# EAGLE design fullcircuit4layer1.1b (EAGLE 7.7.0)
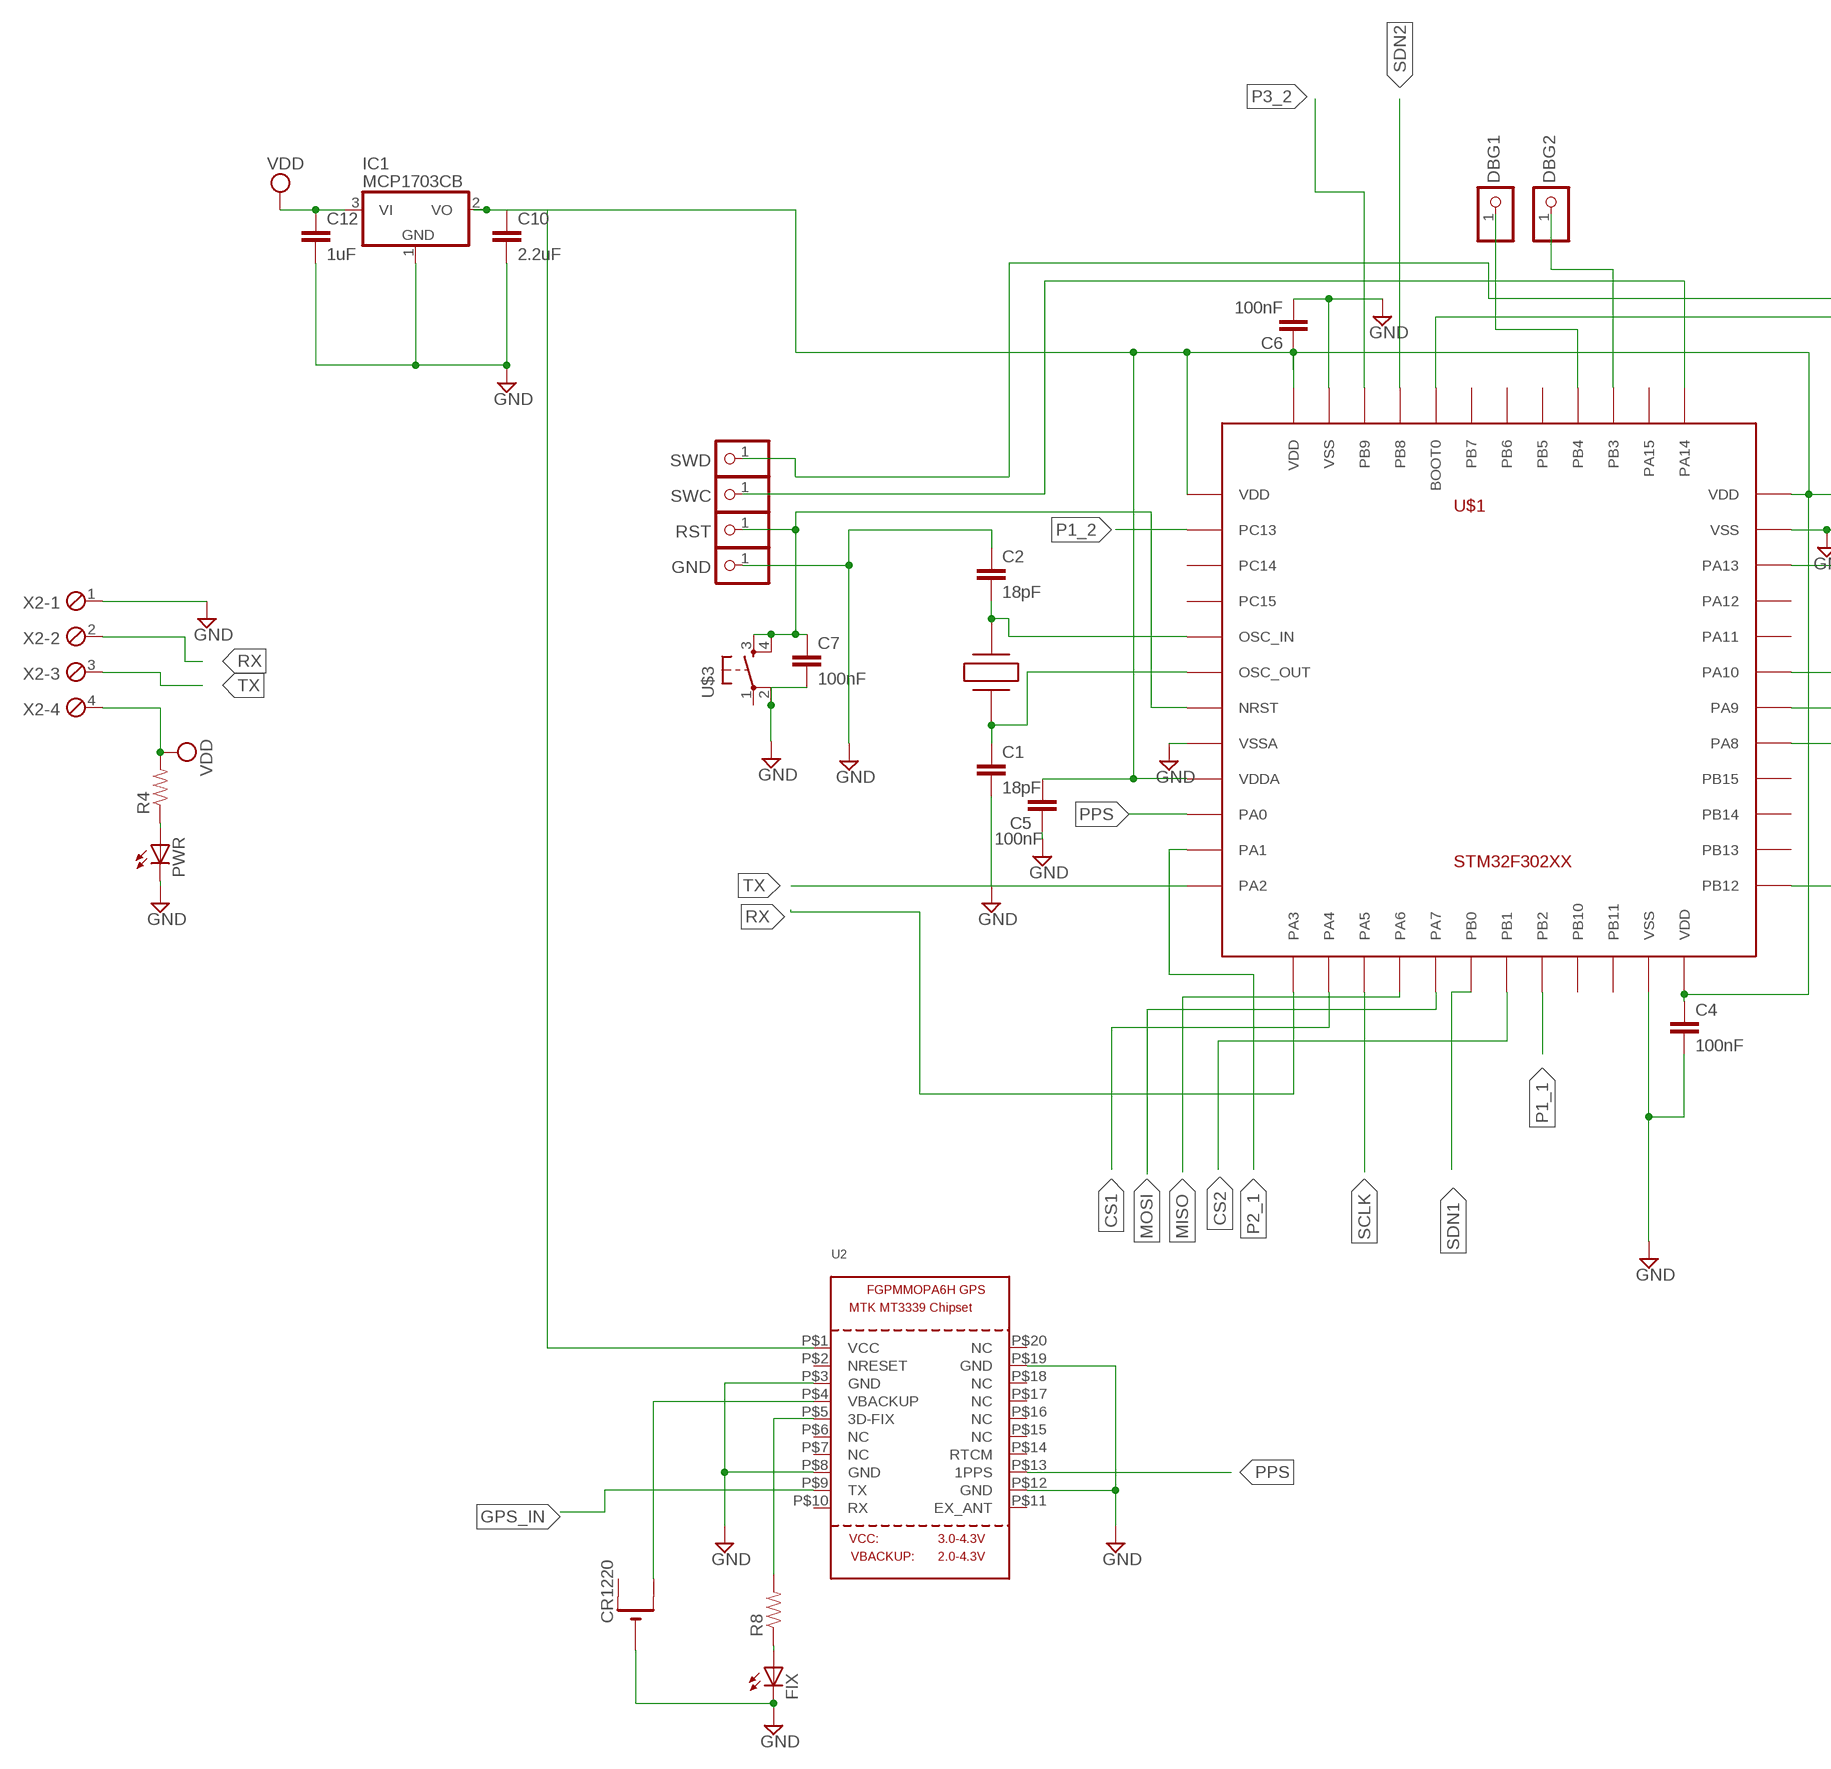
[diagram p0: schematic, sheet 1, part 1 of 2]
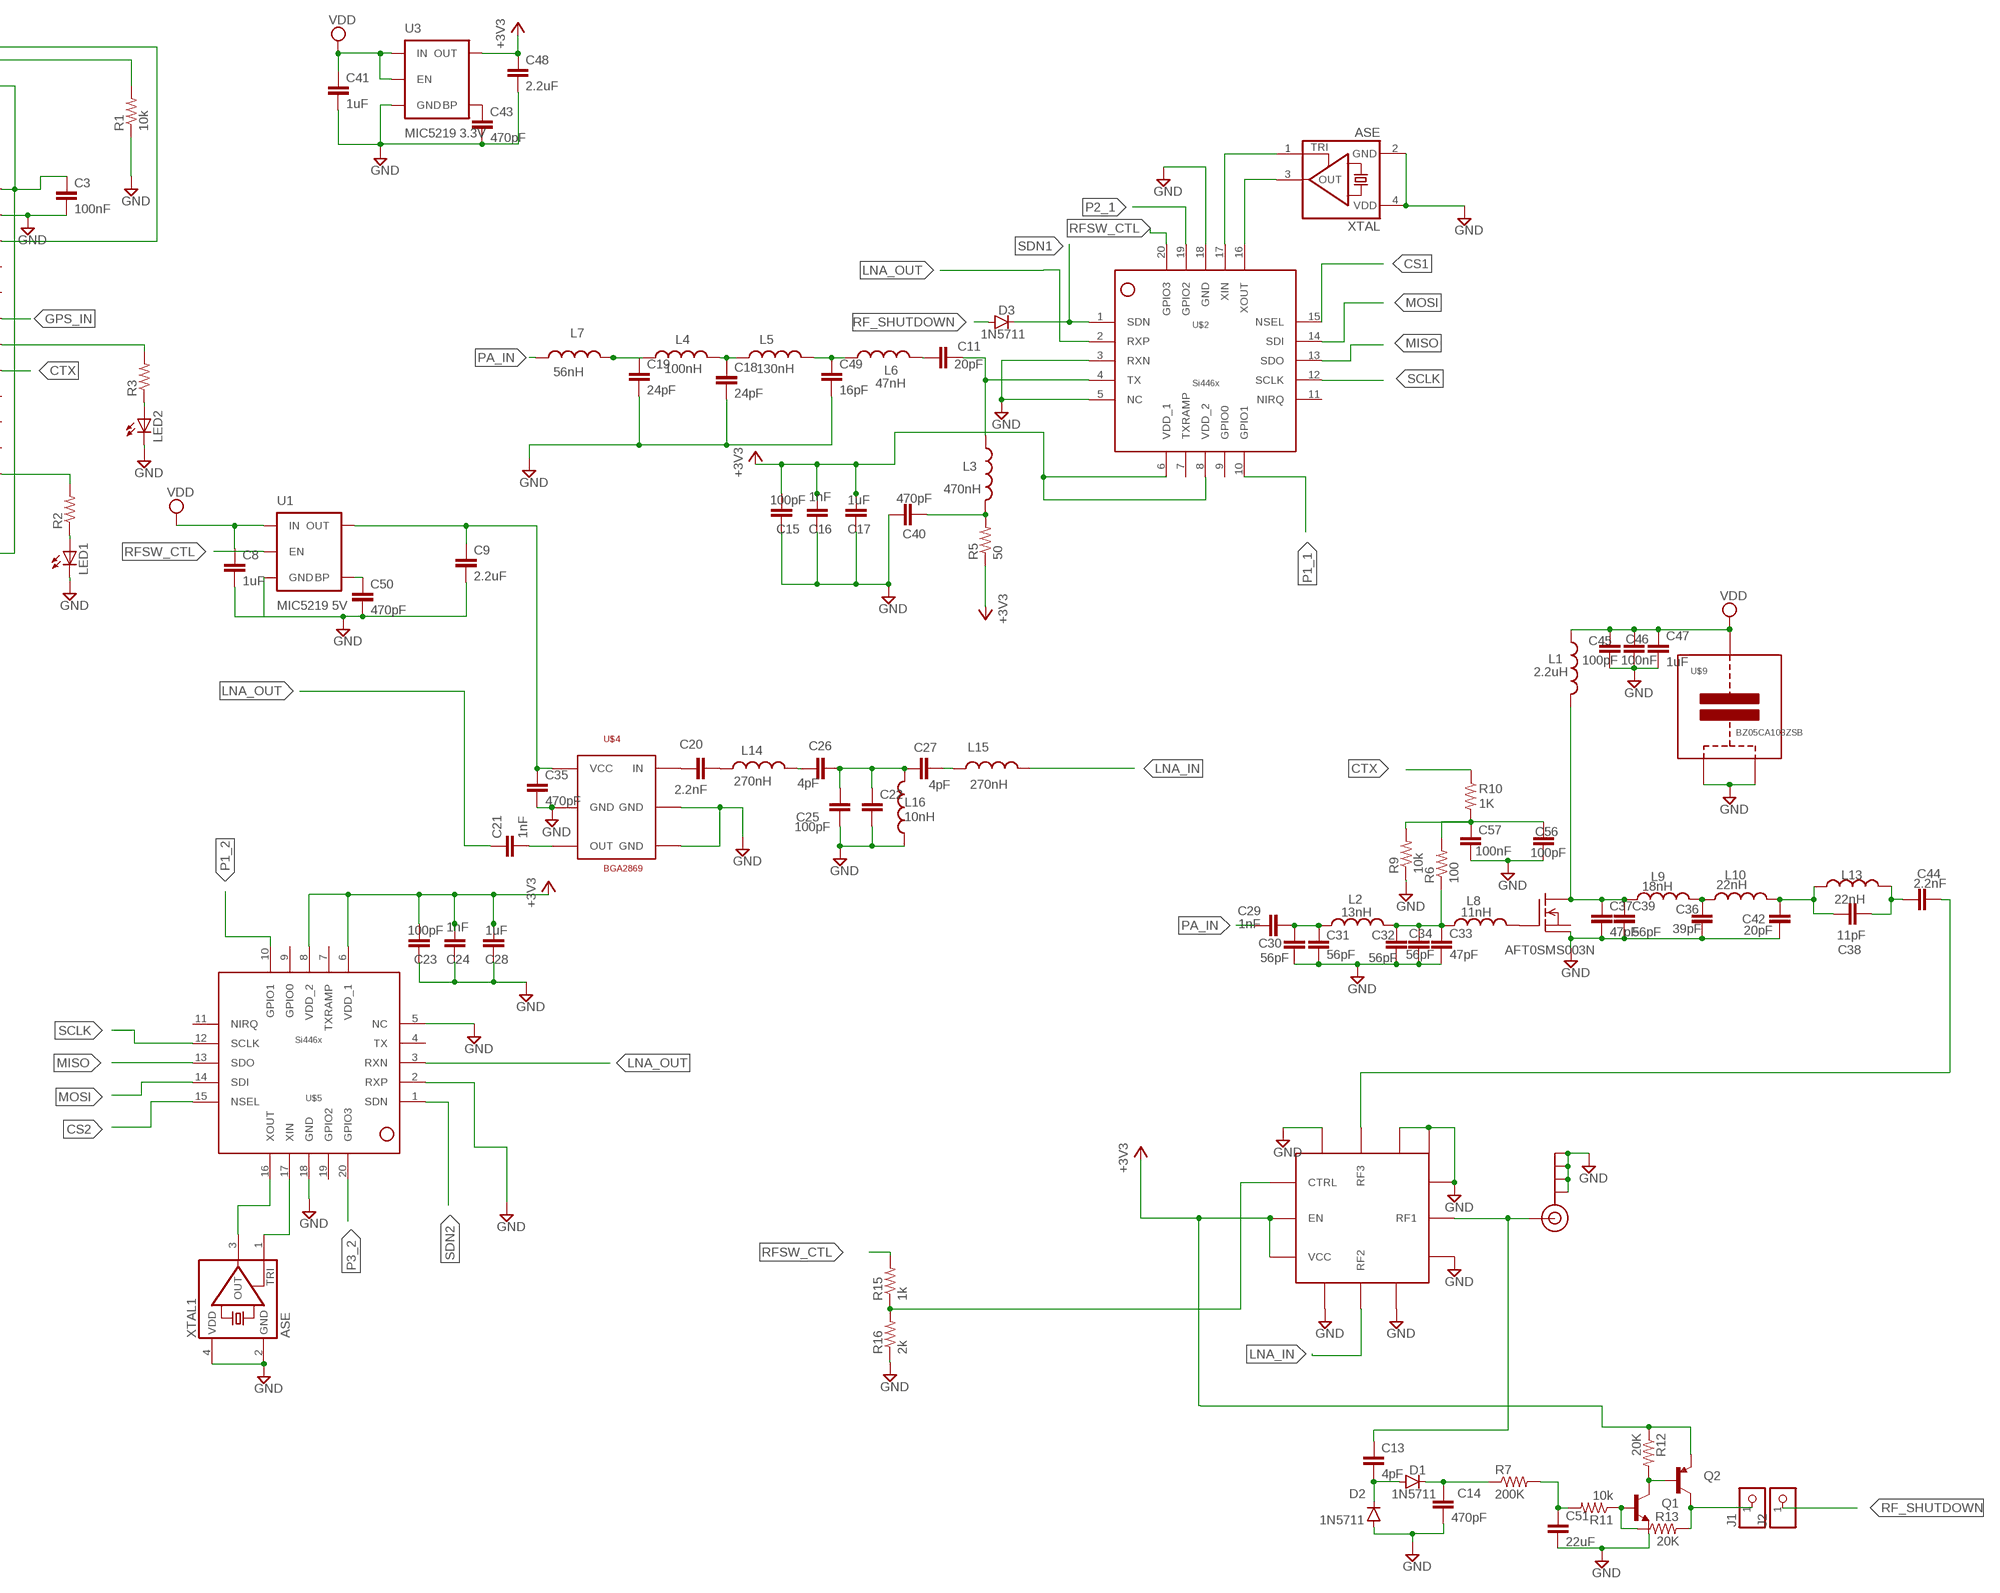
[diagram p1: schematic, sheet 1, part 2 of 2]

## Parts
C1  18pF  CAP0603-CAP  [0603-CAP]
C2  18pF  CAP0603-CAP  [0603-CAP]
C3  100nF  CAP0603-CAP  [0603-CAP]
C4  100nF  CAP0603-CAP  [0603-CAP]
C5  100nF  CAP0603-CAP  [0603-CAP]
C6  100nF  CAP0603-CAP  [0603-CAP]
C7  100nF  CAP0603-CAP  [0603-CAP]
C8  1uF  CAP0603-CAP  [0603-CAP]
C9  2.2uF  CAP0603-CAP  [0603-CAP]
C10  2.2uF  CAP0805  [0805]
C11  20pF  CAP0603-CAP  [0603-CAP]
C12  1uF  CAP0603-CAP  [0603-CAP]
C13  4pF  CAP0603-CAP  [0603-CAP]
C14  470pF  CAP0603-CAP  [0603-CAP]
C15  100pF  CAP0603-CAP  [0603-CAP]
C16  1nF  CAP0603-CAP  [0603-CAP]
C17  1uF  CAP0603-CAP  [0603-CAP]
C18  24pF  CAP0603-CAP  [0603-CAP]
C19  24pF  CAP0603-CAP  [0603-CAP]
C20  2.2nF  CAP0805  [0805]
C21  1nF  CAP0805  [0805]
C22  CAP0603-CAP  [0603-CAP]
C23  100pF  CAP0603-CAP  [0603-CAP]
C24  1nF  CAP0603-CAP  [0603-CAP]
C25  100pF  CAP0603-CAP  [0603-CAP]
C26  4pF  CAP0603-CAP  [0603-CAP]
C27  4pF  CAP0603-CAP  [0603-CAP]
C28  1uF  CAP0603-CAP  [0603-CAP]
C29  1nF  CAP0805  [0805]
C30  56pF  CAP0603-CAP  [0603-CAP]
C31  56pF  CAP0603-CAP  [0603-CAP]
C32  56pF  CAP0603-CAP  [0603-CAP]
C33  47pF  CAP0603-CAP  [0603-CAP]
C34  56pF  CAP0603-CAP  [0603-CAP]
C35  470pF  CAP0603-CAP  [0603-CAP]
C36  39pF  CAP0805  [0805]
C37  47pF  CAP0805  [0805]
C38  11pF  CAP0805  [0805]
C39  56pF  CAP0805  [0805]
C40  470pF  CAP0603-CAP  [0603-CAP]
C41  1uF  CAP0603-CAP  [0603-CAP]
C42  20pF  CAP0805  [0805]
C43  470pF  CAP0603-CAP  [0603-CAP]
C44  2.2nF  CAP0805  [0805]
C45  100pF  CAP0805  [0805]
C46  100nF  CAP0805  [0805]
C47  1uF  CAP0805  [0805]
C48  2.2uF  CAP0603-CAP  [0603-CAP]
C49  16pF  CAP0603-CAP  [0603-CAP]
C50  470pF  CAP0603-CAP  [0603-CAP]
C51  22uF  CAP0805  [0805]
C56  100pF  CAP0603-CAP  [0603-CAP]
C57  100nF  CAP0603-CAP  [0603-CAP]
CR1220  CR1220SMT  [CR1220-SMD]
D1  1N5711  DIODESOD123  [SOD-123]
D2  1N5711  DIODESOD123  [SOD-123]
D3  1N5711  DIODESOD123  [SOD-123]
DBG1  PINHD-1X1  [1X01]
DBG2  PINHD-1X1  [1X01]
FIX  LEDCHIP-LED0603  [CHIP-LED0603]
GND  PINHD-1X1  [1X01]
IC1  MCP1703CB  [SOT23]
J1  PINHD-1X1  [1X01]
J2  PINHD-1X1  [1X01]
J$1  SMA_EDGE  [SMA-EDGE]
L1  2.2uH  INDUCTOR0805  [0805]
L2  13nH  INDUCTOR0603  [0603]
L3  470nH  INDUCTOR0805  [0805]
L4  100nH  INDUCTOR30OHM,1.8A  [0603]
L5  130nH  INDUCTOR30OHM,1.8A  [0603]
L6  47nH  INDUCTOR30OHM,1.8A  [0603]
L7  56nH  INDUCTOR30OHM,1.8A  [0603]
L8  11nH  INDUCTOR0603  [0603]
L9  18nH  INDUCTOR0805  [0805]
L10  22nH  INDUCTOR0805  [0805]
L13  22nH  INDUCTOR0805  [0805]
L14  270nH  INDUCTOR30OHM,1.8A  [0603]
L15  270nH  INDUCTOR30OHM,1.8A  [0603]
L16  10nH  INDUCTOR30OHM,1.8A  [0603]
LED1  LEDCHIP-LED0603  [CHIP-LED0603]
LED2  LEDCHIP-LED0603  [CHIP-LED0603]
PWR  LEDCHIP-LED0603  [CHIP-LED0603]
Q1  TRANSISTOR_NPNSOT23-3  [SOT23-3]
Q2  TRANSISTOR_PNPSMD  [SOT23-3]
R1  10k  RESISTOR0603-RES  [0603-RES]
R2  RESISTOR0603-RES  [0603-RES]
R3  RESISTOR0603-RES  [0603-RES]
R4  RESISTOR0603-RES  [0603-RES]
R5  50  RESISTOR0603-RES  [0603-RES]
R6  100  RESISTOR0603-RES  [0603-RES]
R7  200K  RESISTOR0603-RES  [0603-RES]
R8  RESISTOR0603-RES  [0603-RES]
R9  10k  RESISTOR0603-RES  [0603-RES]
R10  1K  RESISTOR0603-RES  [0603-RES]
R11  10k  RESISTOR0603-RES  [0603-RES]
R12  20K  RESISTOR0603-RES  [0603-RES]
R13  20K  RESISTOR0603-RES  [0603-RES]
R15  1k  RESISTOR0603-RES  [0603-RES]
R16  2k  RESISTOR0603-RES  [0603-RES]
RST  PINHD-1X1  [1X01]
SWC  PINHD-1X1  [1X01]
SWD  PINHD-1X1  [1X01]
U1  MIC5219 5V  V_REG_MIC52195V  [SOT23-5]
U2  GPS_FGPMMOPA6H  [FGPMMOPA6H]
U3  MIC5219 3.3V  V_REG_MIC52193.3V  [SOT23-5]
U$1  STM32F302XX  [LQFP48]
U$2  SI4463  [SI4463]
U$3  TACTILE-SWITCH-7914G  [7914G]
U$4  BGA2869  [SOT363]
U$5  SI4463  [SI4463]
U$6  SKYWORKS-13330397LF  [QFN12]
U$7  AFT0SMS003N  [SOT-89]
U$9  BZ05CA103ZSB  [BZ05]
X1  TXC_7A  [TXC_7A]
X2  MPT4  [4POL254]
XTAL  ASE  [ASE]
XTAL1  ASE  [ASE]

## Nets
+3V3: C15.1 C16.1 C17.1 C23.1 C24.1 C28.1 C48.1 Q2.2(E) R5.1 R12.1 U3.5(OUT) U$2.6(VDD_1) U$2.8(VDD_2) U$5.6(VDD_1) U$5.8(VDD_2) U$6.P$8(EN) U$6.P$9(VCC)
ANT: C13.1 J$1.SIG(SIGNAL) U$6.P$2(RF1)
CS1: U$1.P$14(PA4) U$2.15(NSEL)
CS2: U$1.P$19(PB1) U$5.15(NSEL)
CTX: R10.1 U$1.P$29(PA8)
GND: C1.2 C2.1 C3.2 C4.2 C5.1 C6.2 C7.2 C8.2 C9.2 C10.2 C12.2 C14.2 C15.2 C16.2 C17.2 C18.2 C19.2 C22.2 C23.2 C24.2 C25.1 C28.2 C30.2 C31.2 C32.2 C33.2 C34.2 C35.2 C36.2 C37.2 C39.2 C40.2 C41.2 C42.2 C43.2 C45.2 C46.2 C47.2 C48.2 C49.2 C50.2 C51.2 C56.2 C57.2 CR1220.- D2.A FIX.C GND.1 IC1.1(GND) J$1.GND@0(GND) J$1.GND@1(GND) J$1.GND@2(GND) J$1.GND@3(GND) L16.1 LED1.C LED2.C PWR.C Q1.2(E) R1.1 R9.1 R16.1 U1.2(GND) U2.P$3(GND) U2.P$8(GND) U2.P$12(GND) U2.P$19(GND) U3.2(GND) U$1.P$8(VSSA) U$1.P$23(VSS) U$1.P$35(VSS) U$1.P$47(VSS) U$2.3(RXN) U$2.5(NC) U$2.18(GND) U$3.2 U$4.2(GND) U$4.4(GND) U$4.5(GND) U$5.2(RXP) U$5.5(NC) U$5.18(GND) U$6.P$1(GND) U$6.P$3(GND) U$6.P$4(GND) U$6.P$6(GND) U$6.P$10(GND) U$6.P$12(GND) U$7.2@1(PAD) U$9.P$1 U$9.P$2 X2.1 XTAL1.2(GND) XTAL1.4(VDD) XTAL.2(GND) XTAL.4(VDD)
GPS_IN: U2.P$9(TX) U$1.P$31(PA10)
LNA_IN: L15.2 U$6.P$11(RF2)
LNA_OUT: C21.1 U$2.2(RXP) U$5.3(RXN)
LNAPWR: C9.1 C35.1 U1.5(OUT) U$4.1(VCC)
MISO: U$1.P$16(PA6) U$2.13(SDO) U$5.13(SDO)
MOSI: U$1.P$17(PA7) U$2.14(SDI) U$5.14(SDI)
N$1: U$2.17(XIN) XTAL.1(TRI)
N$2: C19.1 L4.1 L7.2
N$3: C18.1 L4.2 L5.1
N$4: R1.2 U$1.P$44(BOOT0)
N$5: SWC.1 U$1.P$37(PA14)
N$6: R2.2 U$1.P$25(PB12)
N$7: SWD.1 U$1.P$34(PA13)
N$8: C11.1 L3.1 U$2.4(TX)
N$9: C2.2 U$1.P$5(OSC_IN) X1.P$2
N$10: C20.1 U$4.6(IN)
N$11: C21.2 U$4.3(OUT)
N$12: FIX.A R8.1
N$13: U$2.16(XOUT) XTAL.3(OUT)
N$14: LED1.A R2.1
N$15: C20.2 L14.1
N$16: LED2.A R3.1
N$17: R3.2 U$1.P$30(PA9)
N$18: C1.1 U$1.P$6(OSC_OUT) X1.P$1
N$19: PWR.A R4.1
N$20: C49.1 L5.2 L6.1
N$21: DBG2.1 U$1.P$39(PB3)
N$22: C3.1 C4.1 C5.2 C6.1 C10.1 IC1.2(VO) U2.P$1(VCC) U$1.P$1(VDD) U$1.P$9(VDDA) U$1.P$24(VDD) U$1.P$36(VDD) U$1.P$48(VDD)
N$23: C37.1 C39.1 L1.2 L9.1 U$7.3(D)
N$24: DBG1.1 U$1.P$40(PB4)
N$25: L8.2 U$7.1(G)
N$26: C32.1 C33.1 C34.1 L2.2 L8.1 R6.1
N$27: C29.2 C30.1 C31.1 L2.1
N$28: C36.1 L9.2 L10.1
N$29: C38.1 C42.1 L10.2 L13.1
N$30: R8.2 U2.P$5(3D-FIX)
N$31: C43.1 U3.4(BP)
N$32: C13.2 D1.A D2.C
N$33: CR1220.+$2(+1) U2.P$4(VBACKUP)
N$34: C22.1 C25.2 C26.1 C27.2 L16.2
N$35: C27.1 L15.1
N$36: C26.2 L14.2
N$37: C50.1 U1.4(BP)
N$38: U$5.17(XIN) XTAL1.1(TRI)
N$39: U$5.16(XOUT) XTAL1.3(OUT)
N$40: C14.1 D1.C R7.1
N$41: Q1.3(C) Q2.1(B) R12.2
N$42: Q1.1(B) R11.1 R13.1
N$43: C38.2 C44.1 L13.2
N$47: C51.1 R7.2 R11.2
N$50: C11.2 L6.2
N$51: C40.1 L3.2 R5.2
N$89: C56.1 C57.1 R6.2 R9.2 R10.2
N$221: C7.1 RST.1 U$1.P$7(NRST) U$3.3 U$3.4
P1_1: U$1.P$20(PB2) U$2.10(GPIO1)
P1_2: U$1.P$2(PC13) U$5.10(GPIO1)
P2_1: U$1.P$11(PA1) U$2.19(GPIO2)
P3_2: U$1.P$46(PB9) U$5.20(GPIO3)
PA_IN: C29.1 L7.1
PA_OUT: C44.2 U$6.P$5(RF3)
PPS: U2.P$13(1PPS) U$1.P$10(PA0)
RF_DETECT_LOGIC: J1.1 Q2.3(C) R13.2
RF_SHUTDOWN: D3.A J2.1
RFSW_CTL: R15.2 U1.3(EN) U$2.20(GPIO3)
RFSWCTL: R15.1 R16.2 U$6.P$7(CTRL)
RX: U$1.P$13(PA3) X2.2
SCLK: U$1.P$15(PA5) U$2.12(SCLK) U$5.12(SCLK)
SDN1: D3.C U$1.P$18(PB0) U$2.1(SDN)
SDN2: U$1.P$45(PB8) U$5.1(SDN)
TX: U$1.P$12(PA2) X2.3
VDD: C8.1 C12.1 C41.1 C45.1 C46.1 C47.1 IC1.3(VI) L1.1 R4.2 U1.1(IN) U3.1(IN) U3.3(EN) U$9.P$3 X2.4
Unconnected: CR1220.+$1(+) U2.P$2(NRESET) U2.P$6(NC) U2.P$7(NC) U2.P$10(RX) U2.P$11(EX_ANT) U2.P$14(RTCM) U2.P$15(NC) U2.P$16(NC) U2.P$17(NC) U2.P$18(NC) U2.P$20(NC) U$1.P$3(PC14) U$1.P$4(PC15) U$1.P$21(PB10) U$1.P$22(PB11) U$1.P$26(PB13) U$1.P$27(PB14) U$1.P$28(PB15) U$1.P$32(PA11) U$1.P$33(PA12) U$1.P$38(PA15) U$1.P$41(PB5) U$1.P$42(PB6) U$1.P$43(PB7) U$2.7(TXRAMP) U$2.9(GPIO0) U$2.11(NIRQ) U$3.1 U$5.4(TX) U$5.7(TXRAMP) U$5.9(GPIO0) U$5.11(NIRQ) U$5.19(GPIO2) U$6.P$13(GND) U$7.2(S)

## Library data of the parts
C1-C19 C22-C51 C56 C57 = SparkFun-Capacitors:CAP: Capacitor Standard 0603 ceramic capacitor, and 0.1" leaded capacitor.
C20 C21 = SparkFun-Passives:CAP: Capacitor Standard 0603 ceramic capacitor, and 0.1" leaded capacitor.
CR1220 = adafruit:CR1220: CR1216/CR1220/CR1225 12mm 3V lithium coin cell Great for battery packup. Both SMT and THM holders. Note the THM package has the ground pads on both sides of the PCB so that the masks are the same - this reduces the cost
D1-D3 = SparkFun-DiscreteSemi:DIODE: Diode These are standard reverse protection diodes and small signal diodes. SMA package can handle up to about 1A. SOD-323 can handle about 200mA. What the SOD-323 package when ordering, there are some mfgs out there that are 5-pin packages.
DBG1 DBG2 GND RST SWC SWD = adafruit:PINHD-1X1: Pin header 1x1 for 0.1" spacing With round pins
FIX LED1 LED2 PWR = adafruit:LED: LED OSRAM: - CHIPLED LG R971, LG N971, LY N971, LG Q971, LY Q971, LO R971, LY R971 LH N974, LH R974 LS Q976, LO Q976, LY Q976 LO Q996 - Hyper CHIPLED LW Q18S LB Q993, LB Q99A, LB R99A - SideLED LS A670, LO A670, LY A670, LG A670, LP A670 LB A673, LV A673, LT A673, LW A673 LH A674 LY A675 LS A676, LA A676, LO A676, LY A676, LW A676 LS A679, LY A679, LG A679 - Hyper Micro SIDELED® LS Y876, LA Y876, LO Y876, LY Y876 LT Y87S - SmartLED LW L88C, LW L88S LB L89C, LB L89S, LG L890 LS L89K, LO L89K, LY L89K LS L896, LA L896, LO L896, LY L896 - TOPLED LS T670, LO T670, LY T670, LG T670, LP T670 LSG T670, LSP T670, LSY T670, LOP T670, LYG T670 LG T671, LOG T671, LSG T671 LB T673, LV T673, LT T673, LW T673 LH T674 LS T676, LA T676, LO T676, LY T676, LB T676, LH T676, LSB T676, LW T676 LB T67C, LV T67C, LT T67C, LS T67K, LO T67K, LY T67K, LW E67C LS E67B, LA E67B, LO E67B, LY E67B, LB E67C, LV E67C, LT E67C LW T67C LS T679, LY T679, LG T679 LS T770, LO T770, LY T770, LG T770, LP T770 LB T773, LV T773, LT T773, LW T773 LH T774 LS E675, LA E675, LY E675, LS T675 LS T776, LA T776, LO T776, LY T776, LB T776 LHGB T686 LT T68C, LB T68C - Hyper Mini TOPLED® LB M676 - Mini TOPLED Santana® LG M470 LS M47K, LO M47K, LY M47K Source: http://www.osram.convergy.de/
IC1 = linear:MCP1703: 250 mA, 16V, Low Quiescent Current LDO Regulator Source: http://ww1.microchip.com/downloads/en/DeviceDoc/22049b.pdf
J1 J2 = pinhead:PINHD-1X1: PIN HEADER
J$1 = SparkFun-Connectors:SMA_EDGE: SMA Antenna Connector End launch SMA connector. The paste layer has been removed so that the connector can be hand soldered onto the board after reflow.
L1-L3 L8-L10 L13 = SparkFun-Passives:INDUCTOR: Inductors Basic Inductor/Choke - 0603 and 1206. Footprints are not proven and vary greatly between part numbers. INDUCTOR POWER 3.3UH 4.0A SMD 0.197" L x 0.197" W x 0.177" H (5.00mm x 5.00mm x 4.50mm)
L4-L7 L14-L16 = SparkFun-Passives:INDUCTOR: Inductors Basic Inductor/Choke - 0603 and 1206. Footprints are not proven and vary greatly between part numbers. INDUCTOR POWER 3.3UH 4.0A SMD 0.197" L x 0.197" W x 0.177" H (5.00mm x 5.00mm x 4.50mm); PROD_ID: RES-07859
Q1 = SparkFun-DiscreteSemi:TRANSISTOR_NPN: Generic NPN BJT MMBT2222A - TRANS-08049 (SOT-23, 1A 40V) MPSA42 - TRANS-09116 (SOT-23, 500mA 300V) MMBT5088LT1G - TRANS-11160 (SOT-23, 50 mA 30V) BC547 - COM-08928 <http://www.sparkfun.com/products/8928> (TO-92 45V 100mA) (1.Collector 2.Base 3.Emitter) 2N3904 - COM-00521 <http://www.sparkfun.com/products/521> (TO-92 40V 200mA) (1.Emitter 2.Base 3.Collector) P2N2222A - COM-12852 <http://www.sparkfun.com/products/12852> (TO-92 40V 600mA) (1.Collector 2.Base 3.Emitter); PROD_ID: TRANS-08049
Q2 = SparkFun-DiscreteSemi:TRANSISTOR_PNP: Generic PNP BJT Double check pinouts against datasheets- not all devices are the same! MMBT3906 - 40V 200mA SOT-23 (TRANS-08052) MMBT4403 - 40V 600mA SOT-23 (TRANS-09245)
R1-R13 R15 R16 = SparkFun-Passives:RESISTOR: Resistor Basic schematic elements and footprints for 0603, 1206, and PTH resistors.
U1 = SparkFun-PowerIC:V_REG_MIC5219: V_REG MIC5219 Standard 3.3V and 5V 500mA LDO voltage regulator in SOT-23 layout. Micrel part MIC5219. BP (by-pass) pin is used to lower output noise with 470pF cap, may be left open.; PROD_ID: VREG-10107
U2 = adafruit:GPS_FGPMMOPA6H: GPS Module - MTK MT3339 Chipset, -165dBm sensitivity, 22 channels, 10Hz, auto-select external antenna options
U3 = SparkFun-PowerIC:V_REG_MIC5219: V_REG MIC5219 Standard 3.3V and 5V 500mA LDO voltage regulator in SOT-23 layout. Micrel part MIC5219. BP (by-pass) pin is used to lower output noise with 470pF cap, may be left open.; PROD_ID: VREG-09872
U$1 = stm32:STM32F302XX: STM32 Cortex M4 MCU
U$2 U$5 = EZRadioPRO:SI4463
U$3 = GeekAmmo:TACTILE-SWITCH: Tactile Switch 4 Pins, SPST NO
U$4 = nxp:BGA2869
U$6 = skyworks:SKYWORKS-13330397LF: SP2T RF Switch
U$7 = nxp:AFT0SMS003N
U$9 = avx-supercaps:BZ05CA103ZSB: AVX BestCap Supercapacitor
X1 = txc:TXC_7A
X2 = con-phoenix-254:MPT4: PHOENIX CONNECTOR; OC_FARNELL: unknown; OC_NEWARK: unknown
XTAL XTAL1 = crystal:ASE: 3.3Vdc CMOS SMD CRYSTAL CLOCK OSCILLATOR SOurce: www.abracon.com; OC_FARNELL: unknown; OC_NEWARK: unknown

## Board
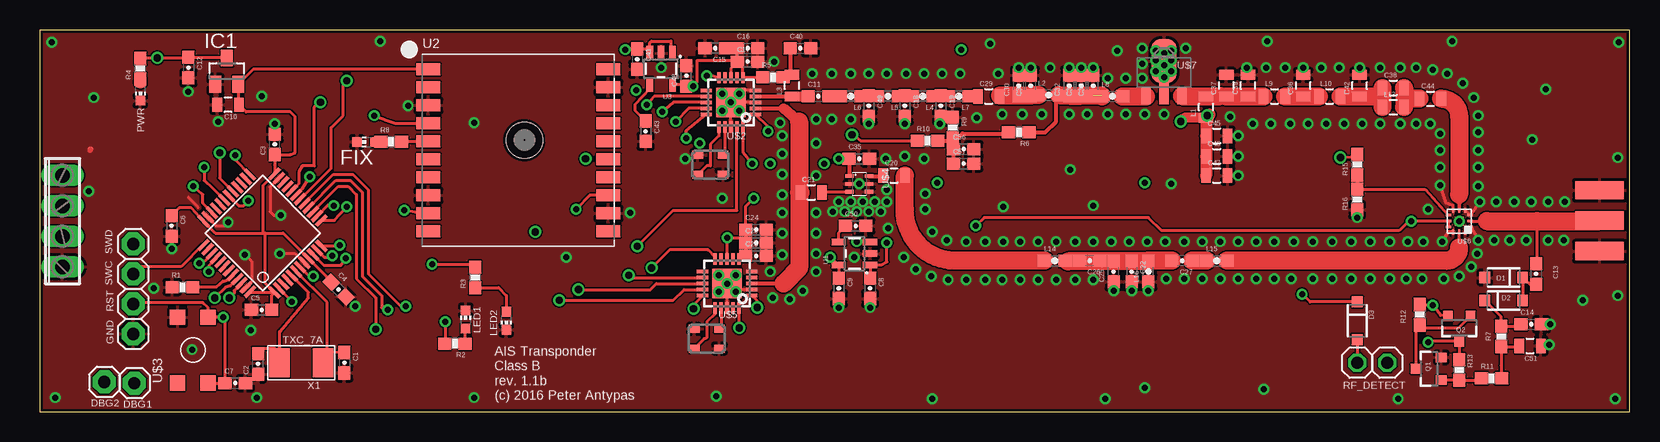
[diagram p2: board, top side]
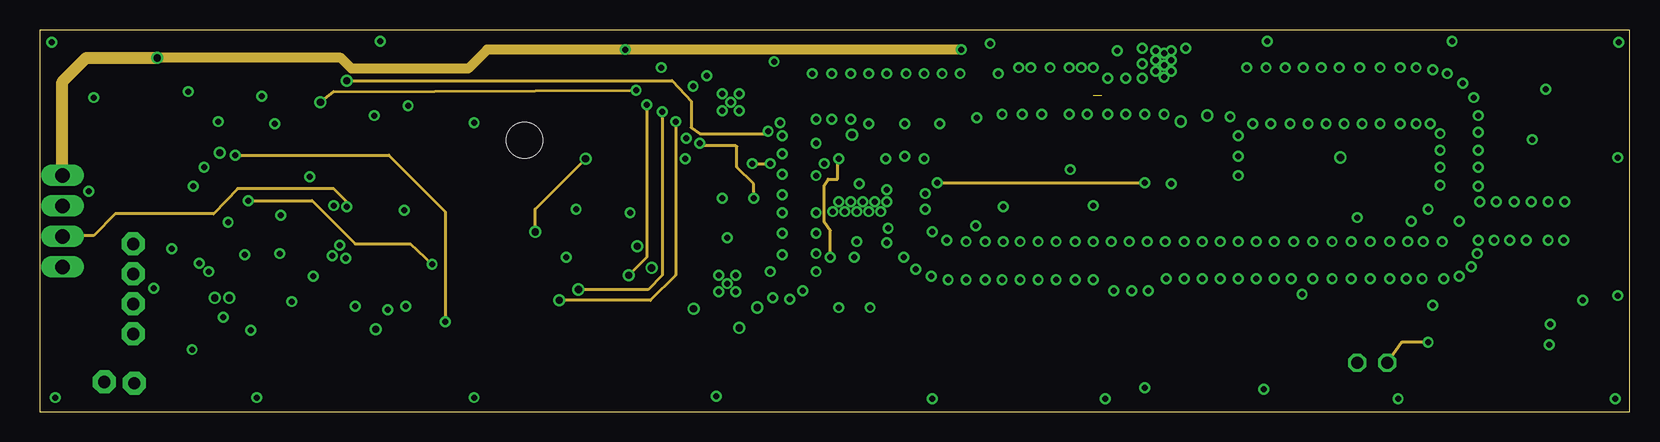
[diagram p3: board, inner layer L2]
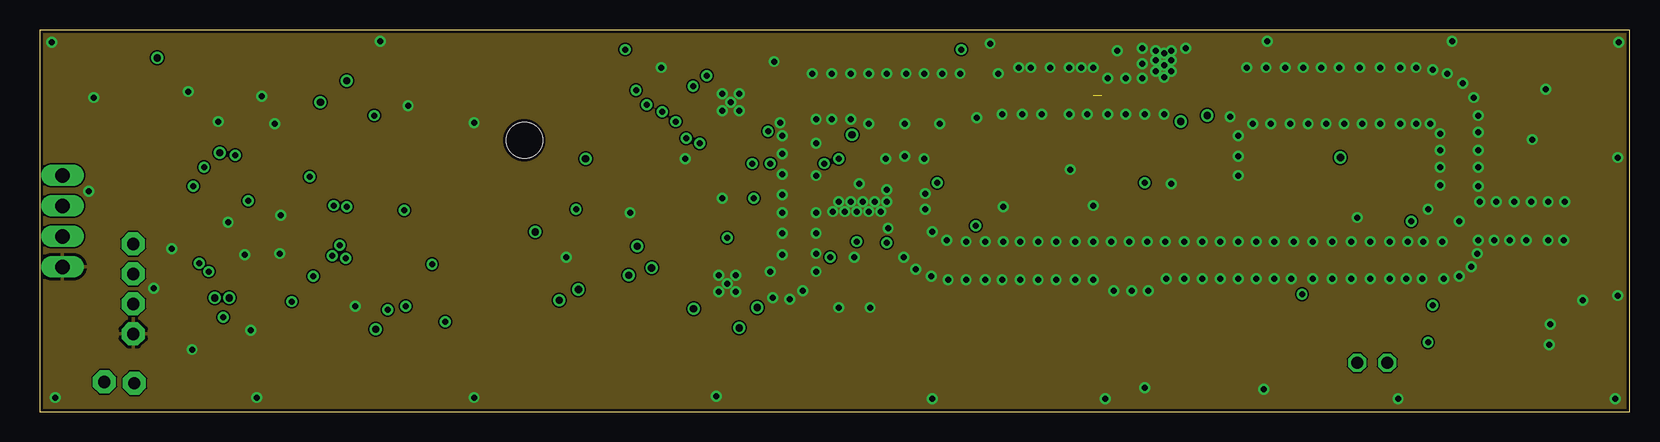
[diagram p4: board, inner layer L3]
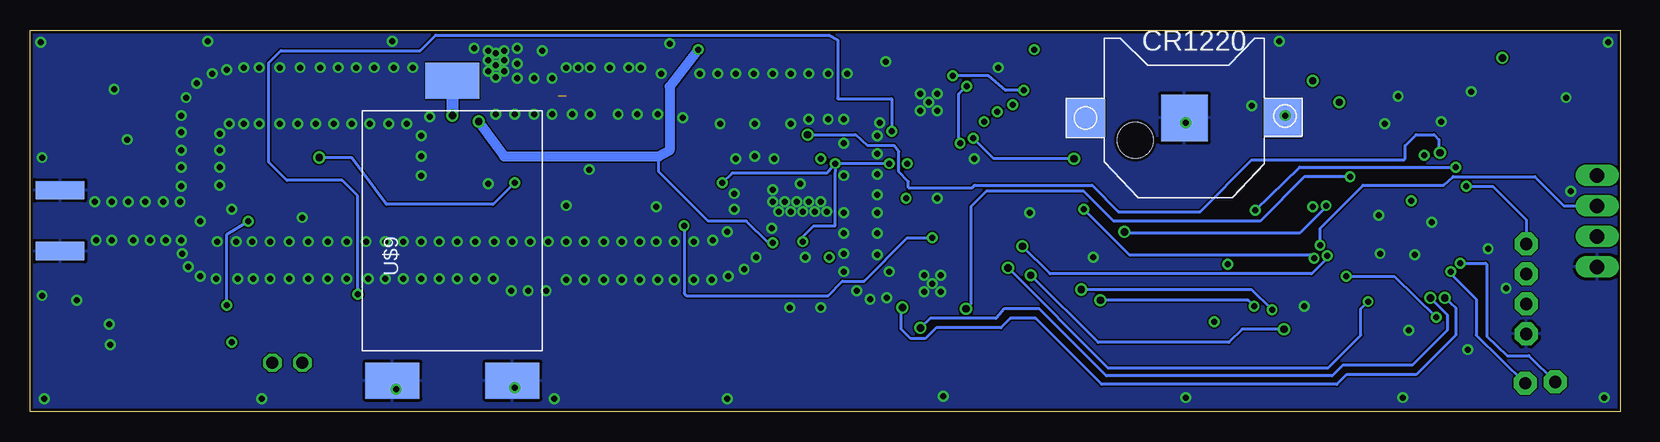
[diagram p5: board, bottom side, seen from below]

Size 132.5 x 31.8 mm. Coordinates in mm from the lower left corner, seen from the top.
Outline: 0,0 132.5,0 132.5,31.8 0,31.8 0,0
Copper layers (1*2+15*16): L1 0.035mm / dielectric 0.17mm / L2 0.018mm / dielectric 1.2mm / L3 0.018mm / dielectric 0.17mm / L4 0.035mm
Design rules "default *": minimum track width 5mil, minimum drill 10mil, track to track 5mil, track to pad 5mil, pad to pad 5mil, via to via 5mil, smd to smd 5mil, copper to edge 10mil, drill to drill 8mil, minimum pad ring 10mil, minimum via ring 8mil, stop-mask expansion 4mil, vias tented up to drill 10mm, thermal gap 10mil

### Footprints (pad centres in the part's own frame; a part is rotated, then mirrored left to right if it is on the bottom)
0603-CAP = smd 1.1 x 1: 1 -0.85,0; 2 0.85,0
0805 = smd 0.8 x 1.2: 1 -0.9,0; 2 0.9,0
CR1220-SMD = smd 3.2 x 3.2: +$1 -8.2,0; +$2 8.2,0 | smd 3.9 x 3.9: - 0,0
SOD-123 = smd 0.9 x 0.95: A 1.575,0; C -1.575,0
1X01 = drill 1.016 pad 1.93 octagon: 1 0,0
CHIP-LED0603 = smd 0.8 x 0.8: A 0,-0.75; C 0,0.75
SOT23 = smd 1 x 1.4: 1 -0.95,-1.1; 2 0.95,-1.1; 3 0,1.1
1X01' = drill 1.016 octagon: 1 0,0
SMA-EDGE = smd 1.524 x 4.064: GND@0 0,0; GND@1 5.08,0; SIG 2.54,0 | smd 1.524 x 4.064 bottom: GND@2 0,0; GND@3 5.08,0
0603 = smd 1.1 x 1: 1 -0.85,0; 2 0.85,0
SOT23-3 = smd 0.8 x 0.9: 1 -0.95,-1; 2 0.95,-1; 3 0,1.1
0603-RES = smd 1.1 x 1: 1 -0.85,0; 2 0.85,0
SOT23-5 = smd 0.55 x 1.2: 1 -0.95,-1.3; 2 0,-1.3; 3 0.95,-1.3; 4 0.95,1.3; 5 -0.95,1.3
FGPMMOPA6H = smd 2 x 1: P$1 -7.5,6.75; P$2 -7.5,5.25; P$3 -7.5,3.75; P$4 -7.5,2.25; P$5 -7.5,0.75; P$6 -7.5,-0.75; P$7 -7.5,-2.25; P$8 -7.5,-3.75; P$9 -7.5,-5.25; P$10 -7.5,-6.75; P$11 7.5,-6.75; P$12 7.5,-5.25; P$13 7.5,-3.75; P$14 7.5,-2.25; P$15 7.5,-0.75; P$16 7.5,0.75; P$17 7.5,2.25; P$18 7.5,3.75; P$19 7.5,5.25; P$20 7.5,6.75 | hole 3: 0.5,0.85
LQFP48 = smd 0.3 x 1.2: P$1 -2.8,-4.2; P$2 -2.3,-4.2; P$3 -1.8,-4.2; P$4 -1.3,-4.2; P$5 -0.8,-4.2; P$6 -0.3,-4.2; P$7 0.2,-4.2; P$8 0.7,-4.2; P$9 1.2,-4.2; P$10 1.7,-4.2; P$11 2.2,-4.2; P$12 2.7,-4.2; P$25 2.7,4.2; P$26 2.2,4.2; P$27 1.7,4.2; P$28 1.2,4.2; P$29 0.7,4.2; P$30 0.2,4.2; P$31 -0.3,4.2; P$32 -0.8,4.2; P$33 -1.3,4.2; P$34 -1.8,4.2; P$35 -2.3,4.2; P$36 -2.8,4.2 | smd 1.2 x 0.3: P$13 4.2,-2.7; P$14 4.2,-2.2; P$15 4.2,-1.7; P$16 4.2,-1.2; P$17 4.2,-0.7; P$18 4.2,-0.2; P$19 4.2,0.3; P$20 4.2,0.8; P$21 4.2,1.3; P$22 4.2,1.8; P$23 4.2,2.3; P$24 4.2,2.8; P$37 -4.2,2.8; P$38 -4.2,2.3; P$39 -4.2,1.8; P$40 -4.2,1.3; P$41 -4.2,0.8; P$42 -4.2,0.3; P$43 -4.2,-0.2; P$44 -4.2,-0.7; P$45 -4.2,-1.2; P$46 -4.2,-1.7; P$47 -4.2,-2.2; P$48 -4.2,-2.7
SI4463 = smd 0.95 x 0.3: 1 -2.05,1; 2 -2.05,0.5; 3 -2.05,0; 4 -2.05,-0.5; 5 -2.05,-1; 11 2.05,-1; 12 2.05,-0.5; 13 2.05,0; 14 2.05,0.5; 15 2.05,1 | smd 0.3 x 0.95: 6 -1,-2.05; 7 -0.5,-2.05; 8 0,-2.05; 9 0.5,-2.05; 10 1,-2.05; 16 1,2.05; 17 0.5,2.05; 18 0,2.05; 19 -0.5,2.05; 20 -1,2.05 | smd 2.45 x 2.45: EXP 0,0
7914G = smd 1.27 x 1.27: 1 0,0; 2 0,5.486; 3 2.54,0; 4 2.54,5.486
SOT363 = smd 0.3 x 0.7: 1 -0.65,-0.8; 2 0,-0.8; 3 0.65,-0.8; 4 0.65,0.8; 5 0,0.8; 6 -0.65,0.8
QFN12 = smd 0.44 x 0.2: P$1 -0.9,0.5; P$2 -0.9,0; P$3 -0.9,-0.5; P$7 0.9,-0.5; P$8 0.9,0; P$9 0.9,0.5 | smd 0.2 x 0.44: P$4 -0.5,-0.9; P$5 0,-0.9; P$6 0.5,-0.9; P$10 0.5,0.9; P$11 0,0.9; P$12 -0.5,0.9 | smd 0.76 x 0.76: P$13 0,0
SOT-89 = smd 0.8 x 1.4: 1 -1.499,-1.981; 3 1.499,-1.981 | smd 0.8 x 1.9: 2 0,-1.727 | smd 2.032 x 3.65: 2@1 0,0.94
BZ05 = smd 3 x 4.5: P$1 -12.5,5; P$2 -12.5,-5; P$3 12.5,0
TXC_7A = smd 1.7 x 2.4: P$1 -1.8,0; P$2 1.8,0
4POL254 = drill 1.2 long: 1 -3.81,0; 2 -1.27,0; 3 1.27,0; 4 3.81,0
ASE = smd 0.9 x 0.65: 1 -1.05,-0.825; 2 1.05,-0.825; 3 1.05,0.825; 4 -1.05,0.825

### Placement (x,y rotation side)
C1  25.4,4.1 270 top
C2  18.2,4 90 top
C3  19.6,22.3 90 top
C4  24.9,10.2 315 top
C5  18.5,8.5 0 top
C6  11,15.5 270 top
C7  16.3,2.4 0 top
C8  69.2,10.3 270 top
C9  66.6,10.3 270 top
C10  15.7,25.6 180 top
C11  64.9,26.3 0 top
C12  12.4,28.7 270 top
C13  124.7,11.5 270 top
C14  124.3,7.3 0 top
C15  56.3,30.3 180 top
C16  59,30.3 0 top
C17  59,29.2 0 top
C18  72.1,25.5 270 top
C19  75.1,25.5 270 top
C20  71.2,19.7 0 top
C21  64.3,18.3 0 top
C22  91,11.7 270 top
C23  59.7,13 0 top
C24  59.7,15.2 0 top
C25  89.5,11.7 90 top
C26  87.5,12.6 180 top
C27  95.2,12.6 180 top
C28  59.7,14.1 0 top
C29  79.1,26.3 0 top
C30  81.6,27.2 90 top
C31  82.6,27.2 90 top
C32  85.8,27.2 90 top
C33  86.8,27.2 90 top
C34  87.8,27.2 90 top
C35  68.3,21.1 0 top
C36  105.3,27.2 90 top
C37  98.9,27.2 90 top
C38  112.8,27 0 top
C39  100.7,27.2 90 top
C40  63.4,30.3 0 top
C41  49.8,29.4 270 top
C42  110,27.2 90 top
C43  50.5,23.4 270 top
C44  115.9,26.1 0 top
C45  98.1,23 0 top
C46  98.1,21.3 0 top
C47  98.1,19.7 0 top
C48  53.9,28 90 top
C49  69.1,25.5 270 top
C50  68,15.5 0 top
C51  124.2,5.5 0 top
C56  77,21.9 0 top
C57  77,20.7 0 top
CR1220  36.3,24.5 0 bottom
D1  122,9.3 0 top
D2  122,11.2 180 top
D3  109.8,7.6 270 top
DBG1  7.9,2.4 0 top
DBG2  5.4,2.5 0 top
FIX  27.2,22.5 90 top
GND  7.8,6.5 0 top
IC1  15.6,28.4 0 top
J1  [1X01']  112.3,4.1 0 top
J2  [1X01']  109.8,4.1 0 top
J$1  130,13.4 90 top
L1  97.2,25.4 90 top
L2  84.1,26.4 0 top
L3  62.7,27.2 90 top
L4  73.6,26.3 180 top
L5  70.7,26.3 180 top
L6  67.6,26.3 180 top
L7  76.6,26.3 180 top
L8  89.4,26.3 0 top
L9  102.9,26.3 0 top
L10  107.5,26.3 0 top
L13  112.8,25.4 0 top
L14  84.6,12.6 0 top
L15  98.1,12.6 0 top
L16  92.4,11.7 90 top
LED1  35.5,7.7 0 top
LED2  38.9,7.6 180 top
PWR  8.4,26.7 180 top
Q1  115.8,3.6 90 top
Q2  118.3,7 180 top
R1  11.9,10.4 0 top
R2  34.6,5.7 180 top
R3  36.3,11.2 90 top
R4  8.4,28.6 90 top
R5  61.1,27.9 0 top
R6  81.6,23.3 180 top
R7  121.8,6.3 270 top
R8  29.3,22.5 0 top
R9  76.1,23.7 270 top
R10  74,22.6 0 top
R11  121,2.8 0 top
R12  115,8.1 270 top
R13  118.3,3.5 90 top
R15  109.8,20.6 90 top
R16  109.8,17.7 90 top
RST  7.8,9 0 top
SWC  7.8,11.5 0 top
SWD  7.8,14 0 top
U1  67.9,13.2 90 top
U2  39.9,21.8 0 top
U3  51.8,28.6 180 top
U$1  18.6,14.9 45 top
U$2  57.6,25.8 180 top
U$3  11.5,2.4 0 top
U$4  68.3,19 270 top
U$5  57.3,10.7 180 top
U$6  118.3,15.9 180 top
U$7  93.7,28.3 0 top
U$9  97.3,15.1 90 bottom
X1  21.8,4.1 180 top
X2  1.9,15.9 90 top
XTAL  55.9,20.6 180 top
XTAL1  55.6,6.1 180 top

### Tracks (layer width: path | path; a pad name or v marks a point on that pad's centre or on a via)
+3V3  (via drill 0.5)
  L1 0.254: 57.1,30.1 57.15,30.05 C15.1 C16.1 C17.1 | R5.1 60.2,27.85 U$2.6 58.6,28.75 C17.1 | C28.1 C24.1 58.85,17.15 v59.5,17.8 | C28.1 C23.1 58.6,12.75 U$5.6 | U$6.P$9 U$6.P$8 v114.3,15.9 114.1,15.9 113.3,15.1 93.5,15.1 92.4,16.2 78.7,16.2 v78,15.5 | U3.5 53.75,27.3 C48.1 v54.45,27.15 54.8,27.5 54.8,29.3 58.05,29.3 | 58.05,29.3 C17.1 | 58.05,29.3 58.05,29.05 57.6,28.6 U$2.8 | C28.1 58.55,14.5 v57.3,14.5 U$5.8 | Q2.2 116.75,8.05 v116.1,8.9 116.05,8.95 R12.1
  L2 0.254: v59.5,17.8 59.5,19 58.1,20.4 58.1,22.1 58,22.2 55.2,22.2 v55,22.4
  L4 0.254: v54.45,27.15 55.1,26.5 55.1,22.5 v55,22.4 | v78,15.5 78,9.9 77.8,9.7 66,9.7 64.8,10.9 63,10.9 59.4,14.5 v57.3,14.5 | v116.1,8.9 116.1,14.8 v114.3,15.9
ANT
  L1 0.254: U$6.P$2 120.6,15.9 | C13.1 124.8,12.55 124.8,15.9
  L1 0.35: 128.16,15.9 J$1.SIG
  L1 1.5: 120.6,15.9 124.8,15.9 129.96,15.9 arc90 J$1.SIG
CS1  (via drill 0.5, 0.6)
  L1 0.254: U$1.P$14 23.12,16.32 24.1,17.3 v24.5,17.2 | v53.9,22.8 53.9,23.45 U$2.15
  L2 0.254: v41.3,15 41.3,16.9 v45.5,21.1
  L4 0.254: v24.5,17.2 24.5,17.1 26.7,14.9 41.2,14.9 v41.3,15 | v45.5,21.1 52.2,21.1 v53.9,22.8
CS2  (via drill 0.5, 0.6)
  L1 0.254: U$1.P$19 21.88,18.58 v22.5,19.6 | v54.5,8.6 54.5,8.95 U$5.15
  L4 0.254: v54.5,8.6 54.1,9 54.1,17.1 52.8,18.4 44.7,18.4 42.2,15.9 30,15.9 26.3,19.6 v22.5,19.6
CTX  (via drill 0.6)
  L1 0.254: v15,21.6 15,19.49 U$1.P$29 | v67.7,23.1 67.9,23.1 68.4,22.6 R10.1
  L4 0.254: v67.7,23.1 63.7,23.1 62.7,22.2 60.5,22.2 60.1,21.7 60.1,20 59.3,19.2 59.3,18.7 54,18.7 53.8,18.9 44,18.9 41.8,16.7 35,16.7 30.7,21 18,21 17.9,21.1 17.9,22.2 17,23.1 15.5,23.1 15.1,22.7 15.1,21.7 v15,21.6
GND  (via drill 0.5)
  L1 0.254: U$1.P$47 17.7,10.89 17.7,12.5 v17.1,13.1 | U$1.P$8 21.29,13.2 v20,13.2 | 13.2,17.05 12.4,17.9 | U$1.P$23 19.2,18.75 19.2,16.7 19.5,16.4 v20.1,16.4 | U$2.18 v57.6,25.8 U$2.3 | U$2.5 58.6,26.8 v58.3,26.5 | U$5.18 v57.3,10.7 | U$5.2 58.2,10.2 v58,10 | v119.9,14.3 119.3,15.4 U$6.P$1 U$6.P$12 | U$6.P$10 117.4,15 v116.9,14.2 | v120,17.5 U$6.P$3 U$6.P$4 | U$6.P$6 117.8,17.2 117.2,17.4 v116.7,18.9 | U$1.P$35 14,16.2 14.7,15.5 15.4,15.5 v15.7,15.8
  L1 0.406: 4.2,21.8 4.2,21.9 4.3,21.9
  other vias: 12.7,5.2 9.5,10.3 18.1,1.2 56.9,26.5 58.3,25.1 56.9,25.1 11,13.6 56.6,11.4 58,11.4 56.6,10 60.9,11.7 61.2,29.2 109.8,16.2 115.7,16.9 121.4,17.5 122.9,17.5 124.3,17.5 125.7,17.5 127.1,17.5 121.2,14.3 122.5,14.3 123.9,14.3 125.7,14.3 127,14.3 119.8,13.2 119.3,12.1 118.3,11.3 117,11.1 115.2,11.1 115.3,14.2 114,14.2 113.9,11.1 112.5,14.2 112.5,11.1 110.9,14.2 110.9,11.1 109.3,14.2 109.3,11.1 107.7,11.1 107.7,14.2 106.1,14.2 106.1,11.1 104.3,11.1 104.5,14.2 102.9,11.1 102.9,14.2 101.4,14.2 99.9,14.2 98.4,14.2 101.4,11.1 99.9,11.1 98.4,11.1 96.9,14.2 95.4,14.2 93.8,14.2 92.3,14.2 90.8,14.2 89.3,14.2 87.8,14.2 86.3,14.2 84.7,14.2 83.2,14.2 81.7,14.2 80.3,14.2 78.8,14.2 77.2,14.2 75.6,14.3 72,12.9 96.9,11.1 95.4,11.1 93.9,11.1 74.4,15 73.8,16.9 73.8,18.2 70.7,15.3 70.1,16.7 70.6,18.5 68.3,19 84.7,11 83.2,11 81.7,11 80.2,11 78.8,11 77.2,11 75.7,11 74.3,11.3 73,11.9 86.3,11 87.8,11 89.5,10.1 91,10.1 92.4,10.1 64.4,28.2 66,28.2 67.6,28.2 69.1,28.2 70.6,28.2 72.2,28.2 73.7,28.2 75.2,28.2 76.7,28.2 69.1,24 72.1,24 75,24 78.1,24.5 80.2,24.8 81.9,24.8 83.5,24.8 81.6,28.7 82.6,28.7 84.2,28.7 85.8,28.7 86.8,28.7 89,27.8 87.8,28.7 90.5,27.8 91.9,27.8 85.8,24.8 89,24.8 90.5,24.8 92.1,24.8 93.7,24.8 102.2,28.7 103.8,28.7 102.6,24 104.2,24 105.7,24 105.3,28.7 107.2,24 108.7,24 110.2,24 106.8,28.7 108.3,28.7 110,28.7 111.7,28.7 113.4,28.7 114.7,28.7 111.7,24 113.4,24 114.7,24 116.1,28.5 117.3,28.2 118.6,27.4 119.5,26.2 119.9,24.7 119.9,23.3 119.9,21.8 119.9,20.4 119.9,18.8 115.9,24 116.7,21.8 116.7,20.4 116.7,23.2 101.1,24 99.9,23 99.9,21.3 99.9,19.7 73.7,21.1 72.1,21.3 70.5,21.1 64.7,19.7 64.7,16.6 64.7,14.9 61.9,16.6 61.9,14.9 61.9,13.1 64.7,13.2 64.7,11.7 63.6,10.1 62.5,9.4 61.1,9.5 61.9,18.1 61.9,19.8 64.7,22.4 61.9,23 91.9,29 91.9,30.3 93.7,27.9 93.7,28.9 93.7,29.9 95.5,30.3 93,29.3 94.3,29.3 93,28.4 94.3,28.4 93,30.1 94.3,30.1 100.6,28.7 99.2,24.6 79.9,28.2 87.3,24.8 118.3,15.9 12.4,26.7 18.5,26.3 28.4,30.9 1,30.8 1.3,1.2 36.2,1.2 56.4,1.3 74.4,1.1 88.8,1.1 69.2,8.7 124.4,22.7 125.8,5.6 131.3,1.1 131.6,30.8 117.7,30.9 79.2,30.7 89.8,30.1 80.3,17.1 87.8,17.2 94.3,19 125.5,26.9 131.5,9.7 131.5,21.2 67.1,16.7 68.1,16.7 69.1,16.7 68.6,17.5 69.6,17.5 17.6,6.8 51.8,28.7 67.9,12.9 53.8,21.1 56.9,17.8 64.7,24.4 61.9,21.5 66,24.4 43.9,12.9 49.2,16.6 30.7,25.5 14.9,24.2 4.5,26.2 4.1,18.4 67.6,24.4 19.6,24 26.3,8.8 85.9,20.2 102.3,30.9 61.7,24.1 67.6,17.5 66.6,17.5 66.1,16.7 70.6,17.5 36.2,24.1 92.1,2 102,1.9 66.6,8.7 128.6,9.3 113.2,1.1 125.9,7.3
  pour L1: -1.3,32.7 133.9,32.7 133.9,-0.7 -1.3,-0.7
  pour L3: -0.2,31.9 132.7,31.7 132.8,-0.1 -0.2,0
  pour L4: -0.5,32.6 133,32.6 133,-0.4 -0.5,-0.4
GPS_IN  (via drill 0.5)
  L1 0.254: U2.P$9 31.55,16.6 v30.4,16.8 | v13.7,20.4 13.7,19.3 14.4,18.68 U$1.P$31
  L4 0.254: v30.4,16.8 26.7,20.4 v13.7,20.4
LNA_IN
  L1 0.254: 118.3,13.7 U$6.P$11
  L1 1.5: L15.2 117.2,12.6 arc90 118.3,13.7
LNA_OUT
  L1 0.35: U$2.2 62,25.3 | 62,10.7 U$5.3
  L1 0.813: 62,25.3 63.3,24.2
  L1 1.5: 63.3,24.2 63.3,18.3 | 63.3,18.3 63.3,12 62,10.7 | C21.1 63.3,18.3
LNAPWR  (via drill 0.5)
  L1 0.254: v65.9,12.9 66.55,12.25 U1.5 C9.1 | v66.6,21.1 C35.1 | C9.1
  L1 0.35: U$4.1 67.5,21.05 C35.1
  L2 0.254: v65.9,12.9 65.9,15.1 65.4,15.8 65.4,18.9 65.7,19.4 66.5,19.4 66.5,21 v66.6,21.1
MISO  (via drill 0.5, 0.6)
  L1 0.254: U$1.P$16 24.7,19.3 25.9,19.3 26.9,18.3 26.9,11.3 28.5,9.7 28.5,8.7 28.7,8.5 v29,8.5 | v44.9,10.2 50.9,10.2 51.4,10.7 U$5.13 | U$2.13 52.8,25.8 v51.9,25
  L2 0.254: v51.9,25 51.9,11.4 50.7,10.2 v44.9,10.2
  L4 0.254: v29,8.5 30.7,10.2 v44.9,10.2
MOSI  (via drill 0.5, 0.6)
  L1 0.254: U$1.P$17 24.49,19.8 26.1,19.8 27.4,18.5 27.4,11.5 30.1,8.8 v30.5,8.8 | v43.3,9.3 52.8,9.3 53.7,10.2 U$5.14 | U$2.14 54.1,25.3 v53,24.2
  L2 0.254: v53,24.2 53,11.4 50.9,9.3 v43.3,9.3
  L4 0.254: v30.5,8.8 31,9.3 v43.3,9.3
N$1
  L1 0.254: U$2.17 57.1,21.57 XTAL.1
N$2
  L1 0.35: L7.2 L4.1 75.05,26.3 C19.1
N$3
  L1 0.35: L4.2 L5.1 72.05,26.3 C18.1
N$4
  L1 0.254: R1.2 14.7,10.4 15.3,10.9 15.69,11 U$1.P$44
N$5
  L1 0.254: U$1.P$37 13.61,13.91 11.8,12.1 8.4,12.1 SWC.1
N$6  (via drill 0.5)
  L1 0.254: U$1.P$25 17.52,19.78 16.3,21 v16.3,21.4 | v33.8,7.5 33.8,5.75 R2.2
  L2 0.254: v16.3,21.4 29.1,21.4 33.8,16.7 v33.8,7.5
N$7  (via drill 0.5)
  L1 0.254: U$1.P$34 14.36,16.64 13.6,17.4 13.6,18.1 v12.8,18.8
  L4 0.254: v12.8,18.8 10.6,18.8 7.8,16 SWD.1
N$8
  L1 0.35: U$2.4 L3.1
  L1 0.813: L3.1 C11.1
N$9
  L1 0.254: C2.2 18.35,5.3 19.6,5.3 19.8,5.1 X1.P$2 20,6.7 22.4,9.5 22.4,9.97 U$1.P$5
N$10
  L1 0.35: U$4.6 70.25,19.65 C20.1
N$11
  L1 0.254: C21.2 65.25,18.35 U$4.3
N$12
  L1 0.254: FIX.A R8.1
N$13
  L1 0.254: U$2.16 56.6,23 55.9,22.3 55.9,20.5 55.58,20.5 XTAL.3
N$14
  L1 0.254: R2.1 35.45,6.9 LED1.A
N$15
  L1 1.5: L14.1 76.2,12.6 arc-90 72.1,16.9 C20.2
N$16
  L1 0.254: R3.1 38.25,10.35 38.9,9.7 LED2.A
N$17  (via drill 0.5)
  L1 0.254: U$1.P$30 15.79,18.01 16.6,17.2 17,17.2 v17.4,17.6 | v32.7,12.3 36.05,12.3 R3.2
  L2 0.254: v17.4,17.6 22.7,17.6 26.3,14 30.9,14 v32.7,12.3
N$18
  L1 0.254: X1.P$1 23.95,5.05 | 23.95,5.05 C1.1 | 23.95,5.05 23.95,9.13 U$1.P$6
N$19
  L1 1.016: R4.1 8.35,27.5 PWR.A
N$20
  L1 0.35: L5.2 L6.1 69.05,26.3 C49.1
N$21  (via drill 0.5)
  L1 0.254: U$1.P$39 14.36,13.16 13.6,12.4 v13.3,12.4
  L4 0.254: v13.3,12.4 11.2,12.4 11.1,12.3 11.1,6.3 9.4,4.7 7.6,4.7 DBG2.1
N$22
  L1 0.254: 18.6,14.9 14.64,14.9 U$1.P$36 12.64,17 11.65,17 C6.1 | 18.6,14.9 18.8,14.9 | 18.8,14.9 20.3,14.9 U$1.P$9 23.9,11.3 C4.1 | 18.6,14.9 18.6,18.86 U$1.P$24 19.59,20.56 C3.1 20.85,21.45 21.3,21.6 21.3,24.6 20.9,25 17.2,25 C10.1 16.55,25.65 IC1.2 17.8,28.55 U2.P$1 | 18.8,14.9 18.8,10.74 U$1.P$1 | U$1.P$1 17.61,9.95 U$1.P$48 | C5.2 19.35,9.71 U$1.P$1
N$23
  L1 0.813: C37.1 98.88,26.32 98.4,26.32 98.38,26.3 L1.2
  L1 1.5: U$7.3 98.4,26.32 | C37.1 C39.1 L9.1
N$24  (via drill 0.5)
  L1 0.254: U$1.P$40 14.71,12.81 14.1,12.2 v14.1,11.7
  L4 0.254: v14.1,11.7 14.1,11.5 12,9.4 12,6.4 DBG1.1
N$25
  L1 0.813: 92.18,26.3 U$7.1
  L1 1.5: L8.2 92.18,26.3
N$26  (1 unrouted)
  L1 0.35: R6.1 83.8,23.3 84.7,24.2 84.7,26.35 L2.2 | 85.75,26.4 C32.1
  L1 1.5: L2.2 85.75,26.4 | C32.1 C33.1 88.5,26.35 L8.1
N$27
  L1 0.35: 82.65,26.4 C31.1 | 80.05,26.35 C29.2
  L1 1.5: L2.1 82.65,26.4 | C31.1 C30.1 80.05,26.35
N$28
  L1 1.5: L9.2 C36.1 L10.1
N$29
  L1 0.813: 111.2,26.3 C38.1
  L1 1.5: L10.2 C42.1 111.2,26.3 | C38.1 L13.1
N$30
  L1 0.254: R8.2 30.2,22.55 U2.P$5
N$31
  L1 0.254: U3.4 50.85,26.95 49.6,25.6 49.6,25.15 C43.1
N$32
  L1 0.254: C13.2 124.2,10.62 D2.C D1.A
N$33  (via drill 0.5)
  L1 0.254: v27.9,24.7 29.65,24.05 U2.P$4
  L4 0.254: CR1220.+$2 28.4,24 v27.9,24.7
N$34
  L1 0.35: 92.35,12.6 L16.2 | 85.7,12.55 C26.1
  L1 1.5: C27.2 92.35,12.6 | L16.2 C22.1 C25.2 85.7,12.55
N$35
  L1 1.5: L15.1 C27.1
N$36
  L1 0.35: C26.2 L14.2
N$37
  L1 0.254: U1.4 66.6,14.95 C50.1
N$38
  L1 0.254: U$5.17 56.8,7.08 XTAL1.1
N$39
  L1 0.254: U$5.16 56.3,8.2 55.6,7.5 55.6,6.2 55.5,6.1 55.38,6.1 XTAL1.3
N$40
  L1 0.254: 120.4,9.32 D1.C 121.75,7.97 121.75,7.2 R7.1 123.3,7.15 C14.1 123.28,7.62
N$41
  L1 0.254: Q2.1 118.25,7 114.8,7 | Q1.3 114.7,6.9 114.8,7 | 114.8,7 114.8,7.05 R12.2
N$42
  L1 0.254: R11.1 120.05,2.65 119.6,2.6 118.35,2.6 R13.1 Q1.1
N$43
  L1 0.254: 113.8,26.1 113.8,25.5 L13.2
  L1 1.5: C38.2 L13.2 | C44.1 113.8,26.1
N$47
  L1 0.254: C51.1 123.25,5.45 R7.2 121.8,3.85 R11.2
N$50
  L1 0.35: C11.2 L6.2
N$51
  L1 0.254: L3.2 62.5,27.9 R5.2
  L1 0.35: C40.1 62.55,28.25 L3.2
N$89
  L1 0.35: R10.2 76.05,22.6 | 76.05,22.6 R9.2 76.55,22.85 76.9,23.2 80.65,23.2 R6.2 | 76.05,22.6 76.05,22 C56.1 C57.1
N$221  (via drill 0.5)
  L1 0.254: U$1.P$7 21.73,12.07 22.4,11.4 v22.8,11.3 | U$3.3 C7.1 15.45,7.75 v15.3,7.9 14.05,7.9 U$3.4 14.04,8.66 13.6,9.1 8,9.1 RST.1
  L4 0.254: v22.8,11.3 18.8,11.3 v15.3,7.9
P1_1  (via drill 0.5, 0.6)
  L1 0.254: 21.04,18.44 U$1.P$20 21.6,19.03 21.6,20 21.9,20.5 22.9,20.5 22.9,25.4 v23.4,25.8 | v55.6,28 56.15,28 U$2.10
  L2 0.254: v23.4,25.8 24.5,26.7 v49.7,26.8
  L4 0.254: v49.7,26.8 51.2,26.8 52.6,28 v55.6,28
P1_2  (via drill 0.5, 0.6)
  L1 0.254: U$5.10 56.3,12.9 55.7,13.5 52.5,13.5 v51,12 | v21,9.2 21.1,9.15 U$1.P$2
  L4 0.254: v51,12 42.7,3.7 24.3,3.7 21.6,6.4 21.6,8.6 v21,9.2
P2_1  (via drill 0.5, 0.6)
  L1 0.254: U$1.P$11 23.12,13.47 23.7,12.9 24.2,12.9 v24.4,13 | v49.8,13.8 52.8,16.8 58.1,16.8 U$2.19
  L4 0.254: v49.8,13.8 47.5,11.5 25.7,11.5 24.3,12.9 v24.4,13
P3_2  (via drill 0.6)
  L1 0.254: U$1.P$46 16.2,10.1 16.2,9.9 v15.8,9.5 | v58.3,7 U$5.20
  L4 0.254: v15.8,9.5 14.4,8.1 14.4,6.8 17.3,3.9 23.1,3.9 24,3 42.8,3 48.4,8.6 51.3,8.6 52,7.8 57.5,7.8 v58.3,7
PA_IN
  L1 0.35: L7.1 C29.1
PA_OUT
  L1 0.305: 118.3,17.6 U$6.P$5
  L1 0.61: 118.3,18.1 118.3,17.6
  L1 1.5: C44.2 arc-90 118.3,24.6 118.3,18.1
PPS  (via drill 0.5)
  L1 0.254: U2.P$13 45.85,18.05 v44.7,16.9 | v25.5,12.8 25.1,12.2 23.7,12.2 U$1.P$10
  L4 0.254: v44.7,16.9 40.9,13.1 25.8,13.1 v25.5,12.8
RF_DETECT_LOGIC  (via drill 0.5)
  L1 0.254: R13.2 Q2.3 115.8,5.9 v115.7,5.8
  L2 0.254: v115.7,5.8 113.5,5.8 J1.1
RF_SHUTDOWN
  L1 0.254: D3.A J2.1
RFSW_CTL  (via drill 0.5, 0.6)
  L1 0.254: v108.4,21.2 109.3,21.25 R15.2 | U$2.20 58.6,21.7 v59.4,20.7 | U1.3 69.05,14.25 v68.1,14.2
  L2 0.254: v74.8,19.1 v92.1,19.1 | v59.4,20.7 v60.9,20.7
  L4 0.254: v74.8,19.1 74,19.9 66.1,19.9 66,20 v65.4,20.7 | v92.1,19.1 93.9,17.3 102.8,17.3 105.7,21.2 v108.4,21.2 | v68.1,14.2 68.1,14.6 67.2,15.5 65.4,15.5 65.4,19.8 65.3,20.6 v65.4,20.7 | v60.9,20.7 v65.4,20.7
RFSWCTL
  L1 0.254: R15.1 R16.2 115.45,18.55 U$6.P$7
RX  (via drill 0.5)
  L1 0.254: U$1.P$13 24.56,15.96 v25.6,17.1
  L2 0.254: X2.2 1.97,14.7 4.5,14.7 6.3,16.5 14.5,16.5 16.5,18.6 24.5,18.6 25.7,17.4 v25.6,17.1
SCLK  (via drill 0.5, 0.6)
  L1 0.254: U$1.P$15 24.9,18.8 25.7,18.8 26.4,18.1 26.4,11.1 28,9.5 v28,6.9 | v49.1,11.4 49.3,11.2 U$5.12 | U$2.12 51.2,26.3 v50.6,25.6
  L2 0.254: v50.6,25.6 50.6,12.9 v49.1,11.4
  L4 0.254: v28,6.9 31.5,6.9 32.6,5.8 43.5,5.8 v49.1,11.4
SDN1  (via drill 0.5, 0.6)
  L1 0.254: U$1.P$18 21.73,17.73 24.3,20.3 24.3,23.7 25.3,24.7 25.3,27.2 v25.6,27.6 | v60.7,23.4 60.7,23.75 U$2.1 | D3.C 105.88,9.18 v105.2,9.8
  L2 0.254: v25.6,27.6 52.7,27.6 54.3,25.9 54.3,23.7 55,23.2 60.3,23.2 v60.7,23.4
  L4 0.254: v105.2,9.8 105.2,18 106.5,19.3 111.1,19.3 112.6,20.8 112.6,29.1 111.6,30.1 100,30.1 98.7,31.4 65.9,31.4 65.2,31 65.2,26.1 60.7,26.1 v60.7,23.4
SDN2  (via drill 0.6)
  L1 0.254: U$1.P$45 15.9,10.5 15.5,10.4 v14.6,9.5 | v59.8,8.7 59.8,9.25 U$5.1
  L4 0.254: v14.6,9.5 13.7,8.7 13.7,6.4 17,3.1 22.8,3.1 23.6,2.3 43.2,2.3 48.7,7.8 50.8,7.8 51.6,7 57,7 57.9,6.1 59.1,6.1 59.9,6.9 59.9,8.6 v59.8,8.7
TX  (via drill 0.5)
  L1 0.254: U$1.P$12 24.74,13.84 v25,13.9
  L4 0.254: v25,13.9 25,15.3 21.4,18.9 14.7,18.9 13.9,19.6 7.1,19.6 4.7,17.2 1.93,17.2 X2.3
VDD  (via drill 0.5, 0.6)
  L1 0.254: IC1.3 15.55,29.55 C12.1 12.35,29.5 v9.8,29.5 8.45,29.5 | v48.8,30.2 48.85,30.25 C41.1 50.5,30.25 U3.3 50.85,30.75 51,30.9 52.6,30.9 52.6,30.05 U3.1 | v70.6,14.1 70.6,12.5 70.15,12.25 U1.1 C8.1 | C8.1
  L1 0.813: L1.1 95.4,24.5 v95.1,24.2 | 8.45,29.5 R4.2
  L1 1.016: C47.1 C46.1 C45.1 L1.1 97.5,24.8 v97.3,24.7
  L2 0.813: v76.8,30.2 v48.8,30.2 37.3,30.2 35.7,28.6 26,28.6 25.1,29.5 v9.8,29.5
  L2 1.016: X2.4 1.9,27.5 3.9,29.5 v9.8,29.5
  L4 0.254: v70.6,14.1 71,14.1 72.8,15.9 76,15.9 80.1,20 80.1,21.1 80.3,21.3
  L4 0.813: v95.1,24.2 93,21.3 80.3,21.3 80.1,21.3 79.2,21.8 79.2,27.1 v76.8,30.2
  L4 1.016: U$9.P$3 v97.3,24.7

### Text on the board
tPlace: RF_DETECT | AIS Transponder / Class B / rev. 1.1b / (c) 2016 Peter Antypas